# EAGLE schematic ATtiny85_programmer board (EAGLE 7.2.0)
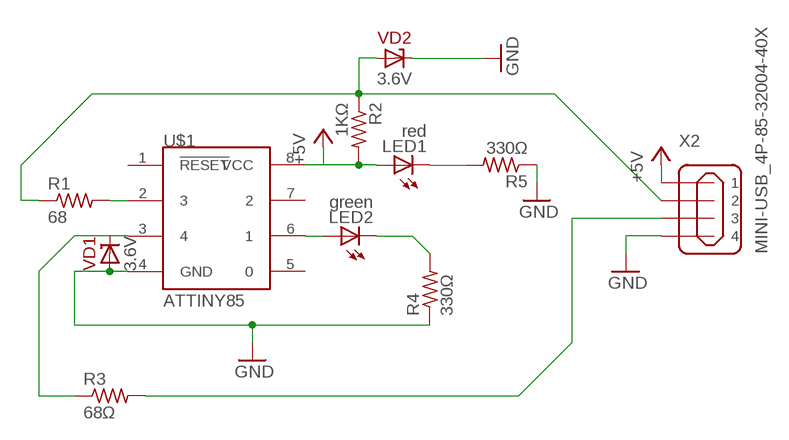
[diagram p0: schematic, sheet 1]

## Parts
LED1  red  LED3MM  [LED3MM]
LED2  green  LED3MM  [LED3MM]
R1  68  R-US_0204/2V  [0204V]
R2  1KΩ  R-US_0204/2V  [0204V]
R3  68Ω  R-US_0204/2V  [0204V]
R4  330Ω  R-US_0204/2V  [0204V]
R5  330Ω  R-US_0204/2V  [0204V]
U$1  ATTINY85  [8P3]
VD1  3.6V  5.6V(1N5232)  [DO35-7]
VD2  3.6V  5.6V(1N5232)  [DO35-7]
X2  MINI-USB_4P-85-32004-40X  [85-32004-40X]

## Nets
+5V: LED1.A R2.2 U$1.8(VCC) X2.1
GND: R4.1 R5.1 U$1.4(GND) VD1.A VD2.C X2.4
N$1: R3.2 X2.3
N$2: R1.2 U$1.2
N$4: R1.1 R2.1 VD2.A X2.2
N$6: R3.1 U$1.3 VD1.C
N$7: LED2.A U$1.6
N$8: LED2.K(C) R4.2
N$10: LED1.K(C) R5.2
Unconnected: U$1.1(!RESET) U$1.5 U$1.7

## Library data of the parts
LED1 LED2 = adafruit:LED: LED OSRAM: - CHIPLED LG R971, LG N971, LY N971, LG Q971, LY Q971, LO R971, LY R971 LH N974, LH R974 LS Q976, LO Q976, LY Q976 LO Q996 - Hyper CHIPLED LW Q18S LB Q993, LB Q99A, LB R99A - SideLED LS A670, LO A670, LY A670, LG A670, LP A670 LB A673, LV A673, LT A673, LW A673 LH A674 LY A675 LS A676, LA A676, LO A676, LY A676, LW A676 LS A679, LY A679, LG A679 - Hyper Micro SIDELED® LS Y876, LA Y876, LO Y876, LY Y876 LT Y87S - SmartLED LW L88C, LW L88S LB L89C, LB L89S, LG L890 LS L89K, LO L89K, LY L89K LS L896, LA L896, LO L896, LY L896 - TOPLED LS T670, LO T670, LY T670, LG T670, LP T670 LSG T670, LSP T670, LSY T670, LOP T670, LYG T670 LG T671, LOG T671, LSG T671 LB T673, LV T673, LT T673, LW T673 LH T674 LS T676, LA T676, LO T676, LY T676, LB T676, LH T676, LSB T676, LW T676 LB T67C, LV T67C, LT T67C, LS T67K, LO T67K, LY T67K, LW E67C LS E67B, LA E67B, LO E67B, LY E67B, LB E67C, LV E67C, LT E67C LW T67C LS T679, LY T679, LG T679 LS T770, LO T770, LY T770, LG T770, LP T770 LB T773, LV T773, LT T773, LW T773 LH T774 LS E675, LA E675, LY E675, LS T675 LS T776, LA T776, LO T776, LY T776, LB T776 LHGB T686 LT T68C, LB T68C - Hyper Mini TOPLED® LB M676 - Mini TOPLED Santana® LG M470 LS M47K, LO M47K, LY M47K Source: http://www.osram.convergy.de/
R1-R5 = adafruit:R-US_: RESISTOR, American symbol
U$1 = attiny85:ATTINY85; OC_FARNELL: unknown
VD1 VD2 = diodes-zener:?; MOUSER: 583-1N5232B-B
X2 = con-cypressindustries:MINI-USB_4P-: MINI USB 4 Pol. Source: www.cypressindustries.com; OC_FARNELL: unknown; OC_NEWARK: unknown

## Net classes
0 default: width 0.254 mm, drill 0.61 mm, clearance 0.305 mm